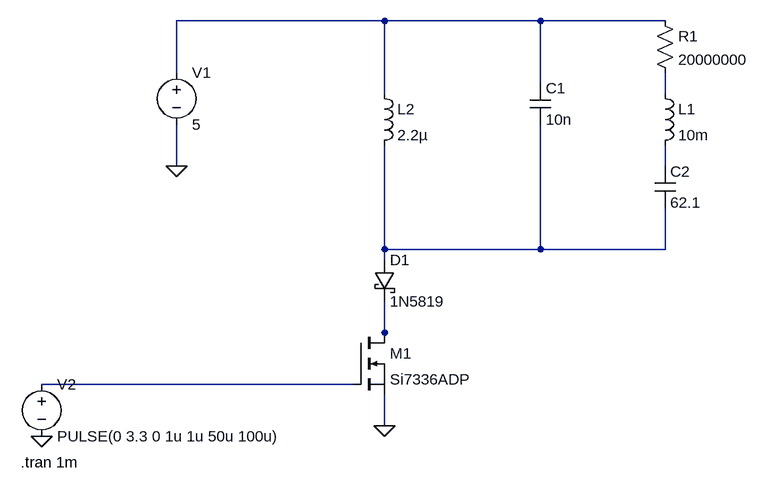
[diagram p0: schematic Prelim-Sim.asc]
Prelim-Sim.asc, the LTspice schematic file:
Version 4
SHEET 1 880 744
WIRE -80 48 -400 48
WIRE 160 48 -80 48
WIRE 352 48 160 48
WIRE -400 128 -400 48
WIRE 160 144 160 48
WIRE -80 160 -80 48
WIRE 352 160 352 128
WIRE -400 272 -400 208
WIRE 352 272 352 240
WIRE -80 400 -80 240
WIRE 160 400 160 208
WIRE 160 400 -80 400
WIRE 352 400 352 336
WIRE 352 400 160 400
WIRE -80 416 -80 400
WIRE -80 528 -80 480
WIRE -80 544 -80 528
WIRE -128 608 -608 608
WIRE -80 672 -80 624
FLAG -400 272 0
FLAG -80 672 0
FLAG -608 688 0
SYMBOL cap 144 144 R0
SYMATTR InstName C1
SYMATTR Value 10n
SYMBOL cap 336 272 R0
SYMATTR InstName C2
SYMATTR Value 62.1
SYMBOL ind 336 144 R0
SYMATTR InstName L1
SYMATTR Value 10m
SYMBOL res 336 32 R0
SYMATTR InstName R1
SYMATTR Value 20000000
SYMBOL voltage -400 112 R0
WINDOW 123 0 0 Left 0
WINDOW 39 0 0 Left 0
SYMATTR InstName V1
SYMATTR Value 5
SYMBOL voltage -608 592 R0
WINDOW 123 0 0 Left 0
WINDOW 39 0 0 Left 0
SYMATTR InstName V2
SYMATTR Value PULSE(0 3.3 0 1u 1u 50u 100u)
SYMBOL nmos -128 528 R0
SYMATTR InstName M1
SYMATTR Value Si7336ADP
SYMBOL ind -96 144 R0
SYMATTR InstName L2
SYMATTR Value 2.2µ
SYMBOL schottky -96 416 R0
SYMATTR InstName D1
SYMATTR Value 1N5819
SYMATTR Description Diode
SYMATTR Type diode
TEXT -640 728 Left 2 !.tran 1m

The netlist it stands for:
* Prelim-Sim.asc
C1 N001 N004 10n
C2 N003 N004 62.1
L1 N002 N003 10m
R1 N001 N002 20000000
V1 N001 0 5
V2 N006 0 PULSE(0 3.3 0 1u 1u 50u 100u)
M1 N005 N006 0 0 Si7336ADP
L2 N001 N004 2.2µ
D1 N004 N005 1N5819
.model D D
.lib standard.dio
.model NMOS NMOS
.model PMOS PMOS
.lib standard.mos
.tran 1m
.backanno
.end